# Altium schematic sheet Controle_Cupula.SchDoc: CONTROLADORA MAIS PIPOCA - REVISÃO EMC
size A3; DocumentNumber: GA0050; SheetNumber: 6; SheetTotal: 17
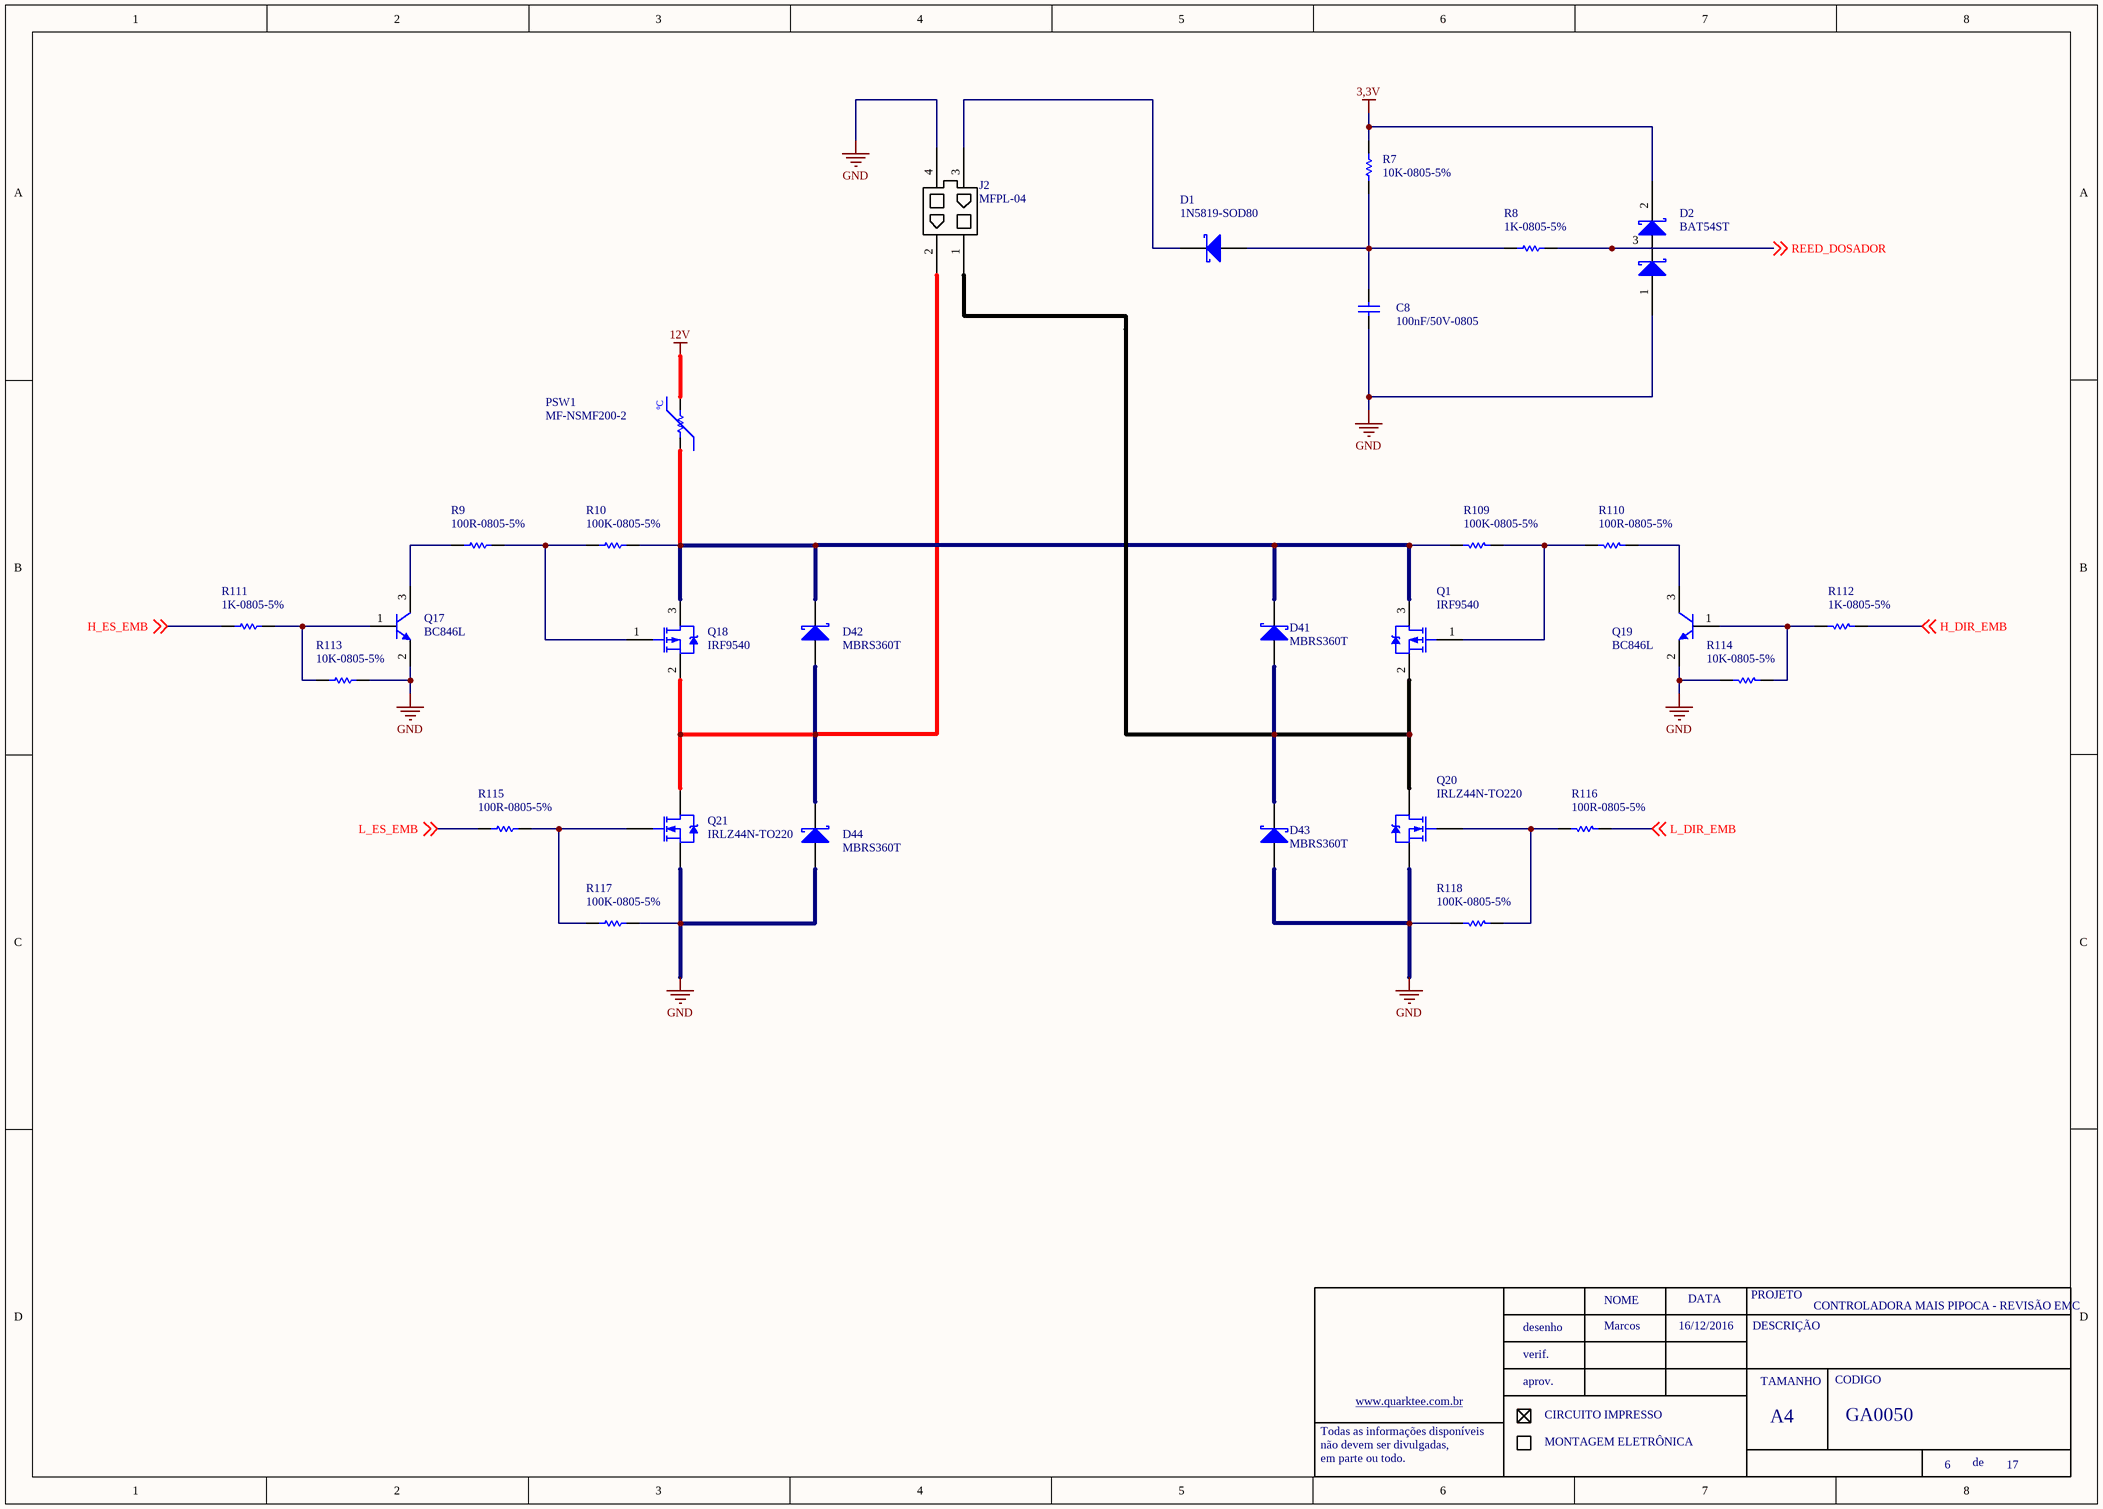
[diagram p0: Controle_Cupula.SchDoc]

## Parts
C8  100nF/50V-0805  [0805-REVISADO ONDA]
D1  1N5819-SOD80  [MINIMLEF/SOD80 - REVISADO ONDA]
D2  BAT54ST  [SOT23 - REVISADO ONDA]
D41  MBRS360T  [DO-214AB]
D42  MBRS360T  [DO-214AB]
D43  MBRS360T  [DO-214AB]
D44  MBRS360T  [DO-214AB]
J2  MFPL-04
PSW1  MF-NSMF200-2  [1206-REVISADO ONDA]
Q1  IRF9540  [TO220-3 EM PÉ]
Q17  BC846L  [SOT23 - REVISADO ONDA]
Q18  IRF9540  [TO220-3 EM PÉ]
Q19  BC846L  [SOT23 - REVISADO ONDA]
Q20  IRLZ44N-TO220  [TO220-3 EM PÉ]
Q21  IRLZ44N-TO220  [TO220-3 EM PÉ]
R7  10K-0805-5%  [0805-REVISADO ONDA]
R8  1K-0805-5%  [0805-REVISADO ONDA]
R9  100R-0805-5%  [0805-REVISADO ONDA]
R10  100K-0805-5%  [0805-REVISADO ONDA]
R109  100K-0805-5%  [0805-REVISADO ONDA]
R110  100R-0805-5%  [0805-REVISADO ONDA]
R111  1K-0805-5%  [0805-REVISADO ONDA]
R112  1K-0805-5%  [0805-REVISADO ONDA]
R113  10K-0805-5%  [0805-REVISADO ONDA]
R114  10K-0805-5%  [0805-REVISADO ONDA]
R115  100R-0805-5%  [0805-REVISADO ONDA]
R116  100R-0805-5%  [0805-REVISADO ONDA]
R117  100K-0805-5%  [0805-REVISADO ONDA]
R118  100K-0805-5%  [0805-REVISADO ONDA]

## Nets
3,3V: D2.2 R7.2
12V: PSW1.2
GND: C8.1 D2.1 D43.1(A) D44.1(A) J2.4 Q17.2(E) Q19.2(E) Q20.3(S) Q21.3(S) R113.2 R114.2 R117.2 R118.2
H_DIR_EMB: R112.1 ; off-sheet H_DIR_EMB
H_ES_EMB: R111.1 ; off-sheet H_ES_EMB
L_DIR_EMB: R116.1 ; off-sheet L_DIR_EMB
L_ES_EMB: R115.1 ; off-sheet L_ES_EMB
REED_DOSADOR: D2.3 R8.2 ; off-sheet REED_DOSADOR
NetC8_2: C8.2 D1.1(A) R7.1 R8.1
NetD1_2: D1.2(K) J2.3
NetD41_1: D41.1(A) D43.2(K) J2.1 Q1.2(DRENO) Q20.2(D)
NetD41_2: D41.2(K) D42.2(K) PSW1.1 Q1.3(SOURCE) Q18.3(SOURCE) R10.2 R109.2
NetD42_1: D42.1(A) D44.2(K) J2.2 Q18.2(DRENO) Q21.2(D)
NetQ1_1: Q1.1(GATE) R109.1 R110.2
NetQ17_1: Q17.1(B) R111.2 R113.1
NetQ17_3: Q17.3(C) R9.1
NetQ18_1: Q18.1(GATE) R9.2 R10.1
NetQ19_1: Q19.1(B) R112.2 R114.1
NetQ19_3: Q19.3(C) R110.1
NetQ20_1: Q20.1(G) R116.2 R118.1
NetQ21_1: Q21.1(G) R115.2 R117.1

## Notes on the sheet
- Marcos
- 16/12/2016
- NOME
- DATA
- PROJETO
- DESCRIÇÃO
- desenho
- verif.
- aprov.
- TAMANHO
- CODIGO
- Todas as informações disponíveis
- não devem ser divulgadas,
- em parte ou todo.
- www.quarktee.com.br
- CIRCUITO IMPRESSO
- MONTAGEM ELETRÔNICA
- A4
- de
- (in symbol POLYSWITCH 200mA) ºC

## Library data of the parts
C8 = 100nF/50-0805-NPO: ERP: 104.11.005
D41-D44 = 1N5819-SOD80: ERP: 121.18.003
PSW1 = POLYSWITCH 200mA: NANOSMDC020F-2; ERP: 128.12.002
Q17 Q19 = BC846: ERP: 106.22.001
R9 R110 = 1K-0805-5%: ERP: 102.11.042
R111 R112 = 10K-0805-5%: ERP: 102.11.054
D1 = 1N5819-SOD80: ERP: 121.18.003
Q20 Q21 = IRLZ44N-TO220: ERP: 107.01.006
R7 R113 R114 = 10K-0805-5%: ERP: 102.11.054
R8 = 1K-0805-5%: ERP: 102.11.042
R10 R109 R117 R118 = 100K-0805-5%: ERP: 102.11.066
R115 R116 = 100R-0805-5%: ERP: 102.11.031